# Altium project BLDC_Drive.PrjPcb
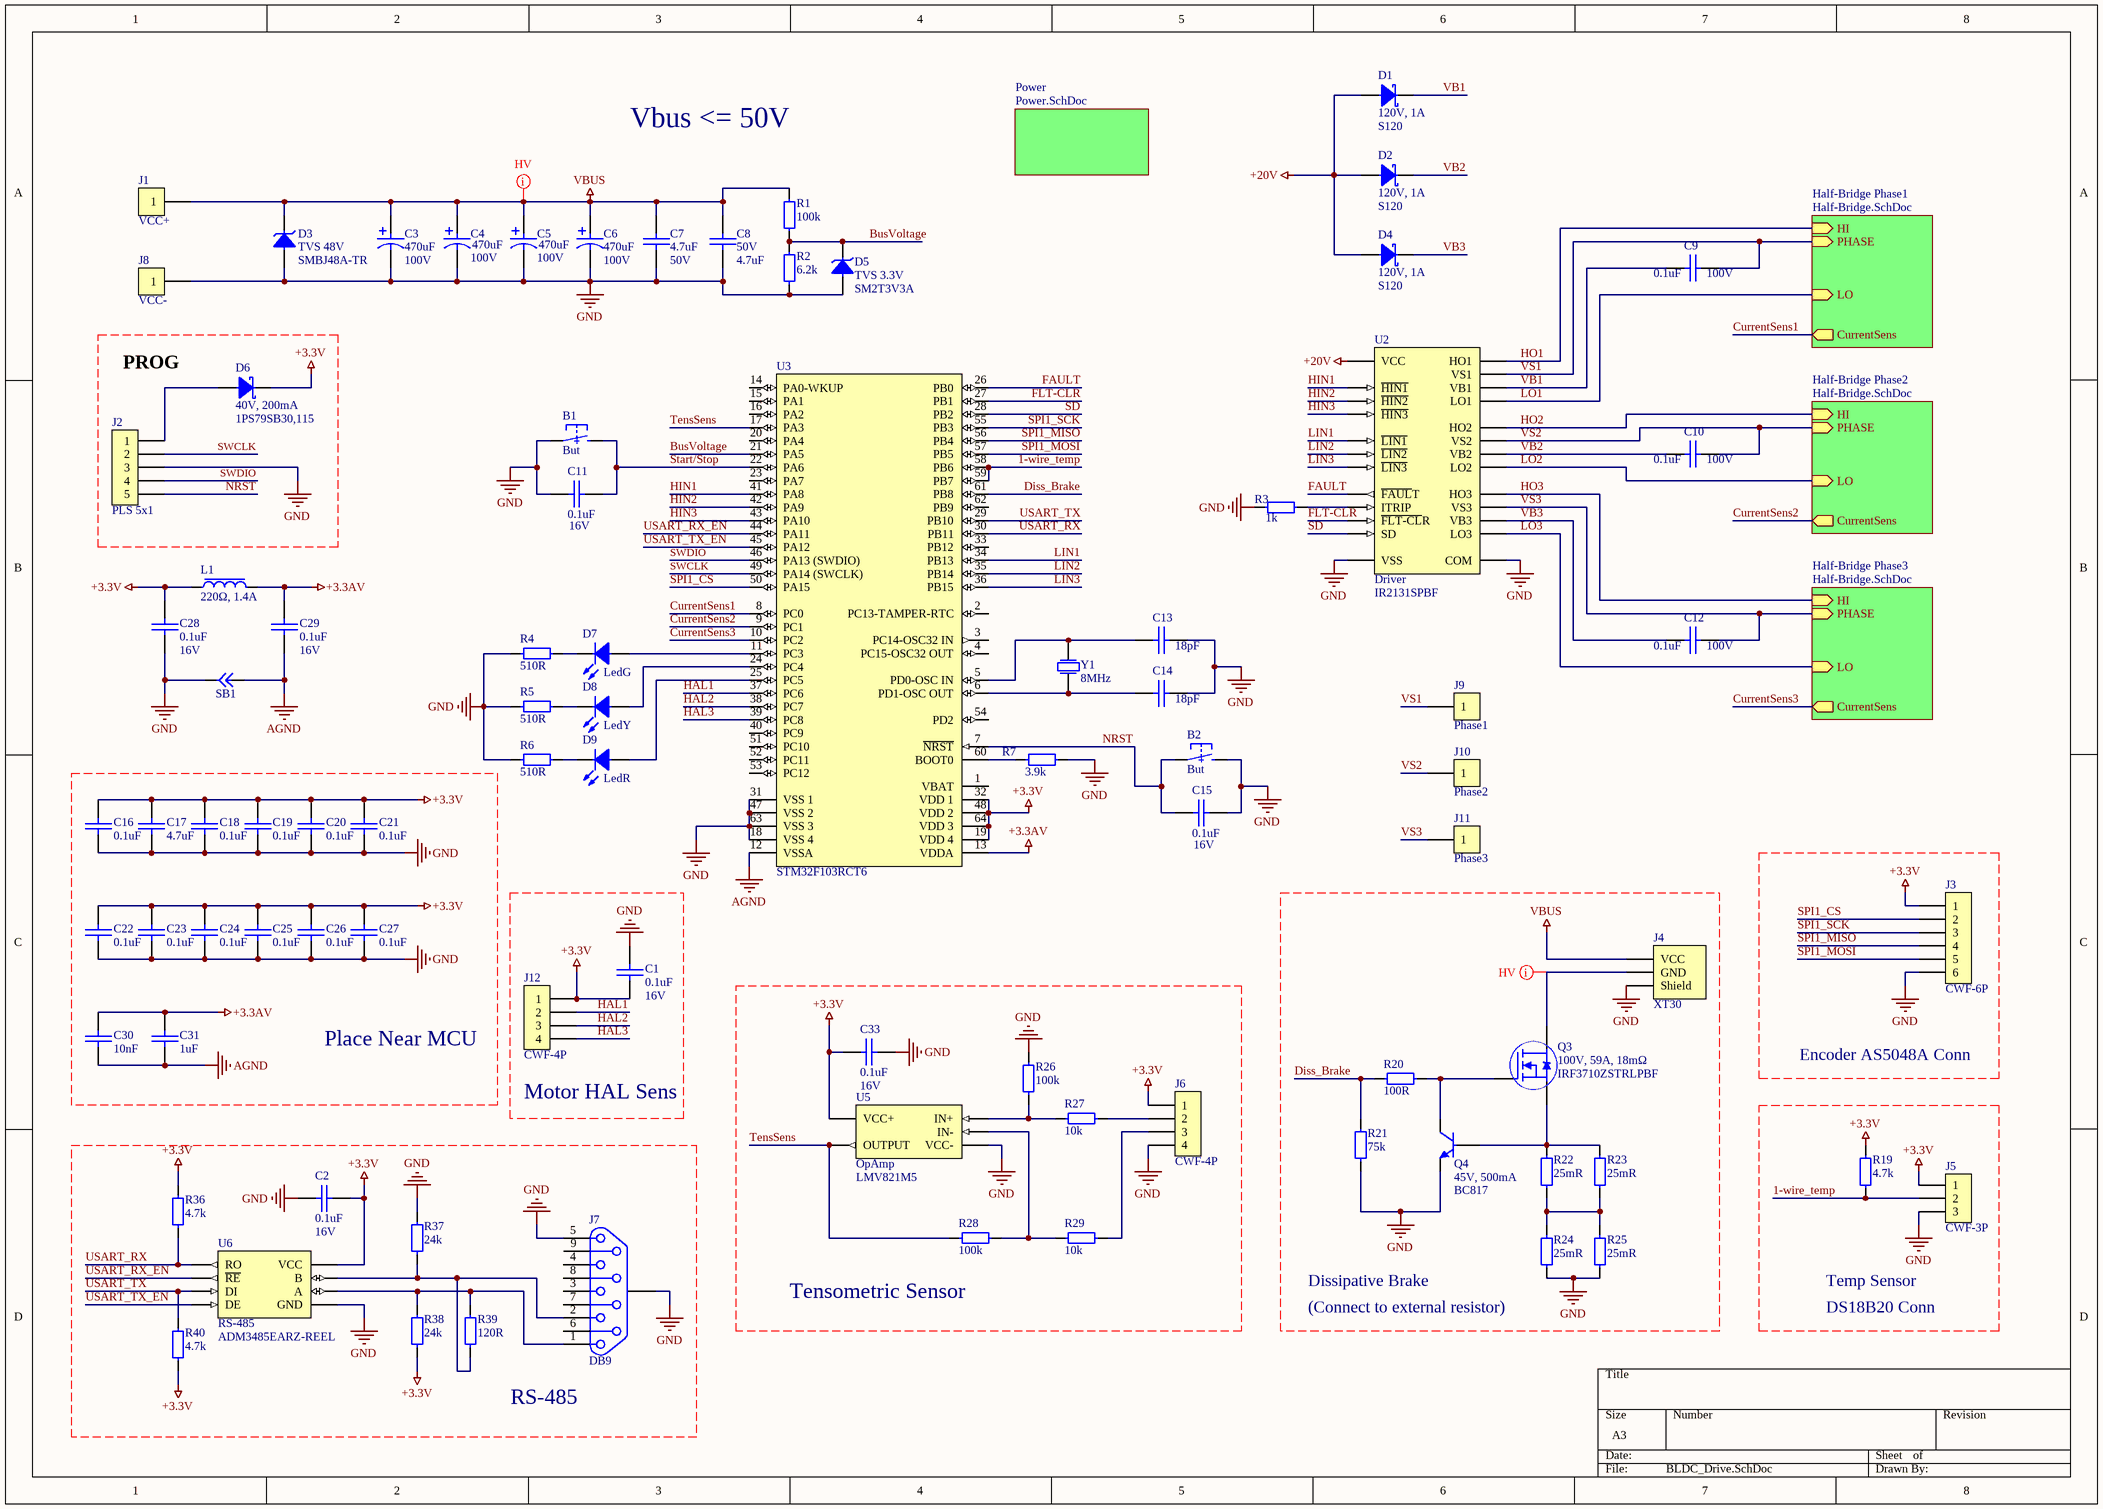
[diagram p0: BLDC_Drive.SchDoc]
3 sheets, 167 parts. Net scope: hierarchical (ports join the sheet entries above them; power ports are global).
Board file: BLDC_Drive.PcbDoc
Sheets:
  BLDC_Drive.SchDoc
    Half-Bridge Phase1 = Half-Bridge.SchDoc
    Half-Bridge Phase2 = Half-Bridge.SchDoc
    Half-Bridge Phase3 = Half-Bridge.SchDoc
    Power = Power.SchDoc

## Sheet BLDC_Drive.SchDoc
size A3; SheetNumber: 1; SheetTotal: 3

### Parts
(Parts that share a designator on the sheet are numbered #1, #2 ... from top to bottom, then left to right.)
B1  But  [BUTTON 6x3.5]
B2  But  [BUTTON 6x3.5]
C1  0.1uF  Voltage: 16V  [0603 Capicator]
C2  0.1uF  Voltage: 16V  [0603 Capicator]
C3  470uF  Voltage: 100V  [ECAP 16x25mm]
C4  470uF  Voltage: 100V  [ECAP 16x25mm]
C5  470uF  Voltage: 100V  [ECAP 16x25mm]
C6  470uF  Voltage: 100V  [ECAP 16x25mm]
C7  4.7uF  Voltage: 50V  [1206 Capacitor]
C8  4.7uF  Voltage: 50V  [1206 Capacitor]
C9  0.1uF  Voltage: 100V  [1206 Capacitor]
C10  0.1uF  Voltage: 100V  [1206 Capacitor]
C11  0.1uF  Voltage: 16V  [0603 Capicator]
C12  0.1uF  Voltage: 100V  [1206 Capacitor]
C13  18pF  [0603 Capicator]
C14  18pF  [0603 Capicator]
C15  0.1uF  Voltage: 16V  [0603 Capicator]
C16  0.1uF  [0603 Capicator]
C17  4.7uF  [0603 Capicator]
C18  0.1uF  [0603 Capicator]
C19  0.1uF  [0603 Capicator]
C20  0.1uF  [0603 Capicator]
C21  0.1uF  [0603 Capicator]
C22  0.1uF  [0603 Capicator]
C23  0.1uF  [0603 Capicator]
C24  0.1uF  [0603 Capicator]
C25  0.1uF  [0603 Capicator]
C26  0.1uF  [0603 Capicator]
C27  0.1uF  [0603 Capicator]
C28  0.1uF  Voltage: 16V  [0603 Capicator]
C29  0.1uF  Voltage: 16V  [0603 Capicator]
C30  10nF  [0603 Capicator]
C31  1uF  [0603 Capicator]
C33#1  0.1uF  Voltage: 16V  [0603 Capicator]
D1  120V, 1A  Part Number: S120  [SOD-123FL]
D2  120V, 1A  Part Number: S120  [SOD-123FL]
D3  TVS 48V  Part Number: SMBJ48A-TR  [SMB]
D4  120V, 1A  Part Number: S120  [SOD-123FL]
D5  TVS 3.3V  Part Number: SM2T3V3A  [DO-216AA]
D6  40V, 200mA  Part Number: 1PS79SB30,115  [SOD-523]
D7  LedG  [0805 LED]
D8  LedY  [0805 LED]
D9  LedR  [0805 LED]
J1  VCC+  [Cable25]
J2  PLS 5x1  [PLS 5x1]
J3  CWF-6P  [Conn6x1]
J4  XT30  [HEADER 2 XT30PW Male]
J5  CWF-3P  [Conn3x1]
J6  CWF-4P  [Conn4x1]
J7  DB9  [DB9]
J8  VCC-  [Cable25]
J9  Phase1  [Cable25]
J10  Phase2  [Cable25]
J11  Phase3  [Cable25]
J12  CWF-4P  [Conn4x1]
L1  220Ω, 1.4A  [0603 Inductor]
Q3#1  100V, 59A, 18mΩ  Part Number: IRF3710ZSTRLPBF  [D2-PAK (TO-262)]
Q4#1  45V, 500mA  Part Number: BC817  [SOT-23]
R1  100k  [0603 Resistor]
R2  6.2k  [0603 Resistor]
R3  1k  [0603 Resistor]
R4  510R  [0603 Resistor]
R5  510R  [0603 Resistor]
R6  510R  [0603 Resistor]
R7  3.9k  [0603 Resistor]
R19  4.7k  [0603 Resistor]
R20  100R  [0603 Resistor]
R21  75k  [0603 Resistor]
R22  25mR  [2512 Resistor]
R23  25mR  [2512 Resistor]
R24#1  25mR  [2512 Resistor]
R25#1  25mR  [2512 Resistor]
R26#1  100k  [0603 Resistor]
R27#1  10k  [0603 Resistor]
R28#1  100k  [0603 Resistor]
R29#1  10k  [0603 Resistor]
R36#1  4.7k  [0603 Resistor]
R37#1  24k  [0603 Resistor]
R38#1  24k  [0603 Resistor]
R39#1  120R  [0603 Resistor]
R40#1  4.7k  [0603 Resistor]
SB1  Circuit Breaker  [SB 0603]  (value not drawn)
U2  Driver  Part Number: IR2131SPBF  [SOIC-28 Wide]
U3  STM32F103RCT6  [LQFP64]
U5  OpAmp  Part Number: LMV821M5  [SOT-23-5]
U6#1  RS-485  Part Number: ADM3485EARZ-REEL  [SOIC-8]
Y1  8MHz  [hc-49sm]

### Sub-sheets
Half-Bridge Phase1 = Half-Bridge.SchDoc: LO (in), HI (in), CurrentSens (out), PHASE (in)
Half-Bridge Phase2 = Half-Bridge.SchDoc: LO (in), HI (in), CurrentSens (out), PHASE (in)
Half-Bridge Phase3 = Half-Bridge.SchDoc: LO (in), HI (in), CurrentSens (out), PHASE (in)
Power = Power.SchDoc: no entries

### Nets
+3.3AV: C29.2 C30.2 C31.2 L1.2 U3.13(VDDA)
+3.3V: C1.1 C2.2 C16.2 C17.2 C18.2 C19.1 C20.2 C21.1 C22.2 C23.2 C24.2 C25.2 C26.2 C27.2 C28.2 C33#1.1 D6.2 J3.1 J5.1 J6.1 J12.1 L1.1 R19.2 R36#1.2 R38#1.1 R40#1.1 U3.19(VDD_4) U3.32(VDD_1) U3.48(VDD_2) U3.64(VDD_3) U5.5(VCC+) U6#1.8(VCC)
+20V: D1.1 D2.1 D4.1 U2.1(VCC)
AGND: C29.1 C30.1 C31.1 SB1.2 U3.12(VSSA)
GND: B1.1 B2.2 C1.2 C2.1 C3.1 C4.1 C5.1 C6.1 C7.1 C8.1 C11.1 C13.2 C14.2 C15.2 C16.1 C17.1 C18.1 C19.2 C20.1 C21.2 C22.1 C23.1 C24.1 C25.1 C26.1 C27.1 C28.1 C33#1.2 D3.1 D5.1 J2.3 J3.6 J4.A(Shield) J5.3 J6.4 J7.5 J7.A J8.1 Q4#1.2 R2.1 R3.1 R4.1 R5.1 R6.1 R7.2 R21.1 R24#1.1 R25#1.1 R26#1.1 R37#1.2 SB1.1 U2.12(VSS) U2.13(COM) U3.18(VSS_4) U3.31(VSS_1) U3.47(VSS_2) U3.63(VSS_3) U5.2(VCC-) U6#1.5(GND)
VBUS: C3.2 C4.2 C5.2 C6.2 C7.2 C8.2 D3.2 J1.1 J4.1(VCC) R1.2
1-wire_temp: J5.2 R19.1 U3.58(PB6) U3.59(PB7)
BusVoltage: D5.2 R1.1 R2.2 U3.21(PA5)
CurrentSens1: U3.8(PC0) ; sheet Half-Bridge Phase1/CurrentSens
CurrentSens2: U3.9(PC1) ; sheet Half-Bridge Phase2/CurrentSens
CurrentSens3: U3.10(PC2) ; sheet Half-Bridge Phase3/CurrentSens
Diss_Brake: R20.1 R21.2 U3.61(PB8)
FAULT: U2.8(~{FAUL}T) U3.26(PB0)
FLT-CLR: U2.10(~{FLT-CL}R) U3.27(PB1)
HAL1: J12.2 U3.37(PC6)
HAL2: J12.3 U3.38(PC7)
HAL3: J12.4 U3.39(PC8)
HIN1: U2.2(~{HIN1}) U3.41(PA8)
HIN2: U2.3(~{HIN2}) U3.42(PA9)
HIN3: U2.4(~{HIN3}) U3.43(PA10)
HO1: U2.27(HO1) ; sheet Half-Bridge Phase1/HI
HO2: U2.23(HO2) ; sheet Half-Bridge Phase2/HI
HO3: U2.19(HO3) ; sheet Half-Bridge Phase3/HI
LIN1: U2.5(~{LIN1}) U3.34(PB13)
LIN2: U2.6(~{LIN2}) U3.35(PB14)
LIN3: U2.7(~{LIN3}) U3.36(PB15)
LO1: U2.16(LO1) ; sheet Half-Bridge Phase1/LO
LO2: U2.15(LO2) ; sheet Half-Bridge Phase2/LO
LO3: U2.14(LO3) ; sheet Half-Bridge Phase3/LO
NRST: B2.1 C15.1 J2.5 U3.7(~{NRST})
SD: U2.11(SD) U3.28(PB2)
SPI1_CS: J3.2 U3.50(PA15)
SPI1_MISO: J3.4 U3.56(PB4)
SPI1_MOSI: J3.5 U3.57(PB5)
SPI1_SCK: J3.3 U3.55(PB3)
Start/Stop: B1.2 C11.2 U3.22(PA6)
SWCLK: J2.2 U3.49(PA14_(SWCLK))
SWDIO: J2.4 U3.46(PA13_(SWDIO))
TensSens: R28#1.2 U3.17(PA3) U5.4(OUTPUT)
USART_RX: R36#1.1 U3.30(PB11) U6#1.1(RO)
USART_RX_EN: U3.44(PA11) U6#1.2(~{RE})
USART_TX: R40#1.2 U3.29(PB10) U6#1.4(DI)
USART_TX_EN: U3.45(PA12) U6#1.3(DE)
VB1: C9.2 D1.2 U2.28(VB1)
VB2: C10.2 D2.2 U2.24(VB2)
VB3: C12.2 D4.2 U2.20(VB3)
VS1: C9.1 J9.1 U2.26(VS1) ; sheet Half-Bridge Phase1/PHASE
VS2: C10.1 J10.1 U2.22(VS2) ; sheet Half-Bridge Phase2/PHASE
VS3: C12.1 J11.1 U2.18(VS3) ; sheet Half-Bridge Phase3/PHASE
NetC13_1: C13.1 U3.5(PD0-OSC_IN) Y1.2
NetC14_1: C14.1 U3.6(PD1-OSC_OUT) Y1.1
NetD6_1: D6.1 J2.1
NetD7_1: D7.1 U3.11(PC3)
NetD7_2: D7.2 R4.2
NetD8_1: D8.1 U3.24(PC4)
NetD8_2: D8.2 R5.2
NetD9_1: D9.1 U3.25(PC5)
NetD9_2: D9.2 R6.2
NetJ4_2: J4.2(GND) Q3#1.2(Drain)
NetJ6_2: J6.2 R27#1.2
NetJ6_3: J6.3 R29#1.2
NetJ7_1: J7.1 R38#1.2 R39#1.2 U6#1.6(A)
NetJ7_2: J7.2 R37#1.1 R39#1.1 U6#1.7(B)
NetQ3#1_1: Q3#1.1(Gate) Q4#1.3 R20.2
NetQ3#1_3: Q3#1.3(Source) Q4#1.1 R22.2 R23.2
NetR3_2: R3.2 U2.9(ITRIP)
NetR7_1: R7.1 U3.60(BOOT0)
NetR22_1: R22.1 R23.1 R24#1.2 R25#1.2
NetR26#1_2: R26#1.2 R27#1.1 U5.1(IN+)
NetR28#1_1: R28#1.1 R29#1.1 U5.3(IN-)

Not connected (* = marked no-connect by the designer): J7 3 4 6 7 8 9; U3 1(VBAT) 2(PC13-TAMPER-RTC) 3(PC14-OSC32_IN) 4(PC15-OSC32_OUT) 14(PA0-WKUP) 15(PA1) 16(PA2) 20(PA4) 23(PA7) 33(PB12) 40(PC9) 51(PC10) 52(PC11) 53(PC12) 54(PD2) 62(PB9)

### Layout directives
net class HV: NetJ4_2, VBUS

### Notes on the sheet
- Vbus <= 50V
- PROG
- Place Near MCU
- (near J12) Motor HAL Sens
- Encoder AS5048A Conn
- (near R28#1) Tensometric Sensor
- Dissipative Brake
- (Connect to external resistor)
- Temp Sensor
- DS18B20 Conn
- RS-485

### Library data of the parts
B1 B2 = Button 2 Conn: Button 2 Conn SMD; Part Number: L-KLS7-TS3608-5.0-180; Manufacturer: KLS electronic co ltd; Type: Button; ComponentLink1Description: Chip&Dip; ComponentLink1URL: https://www.chipdip.ru/product/kls7-ts3608-5.0-180-td-02xa
C1 C2 C11 C15 C16 C18-C29 C33#1 = Cap 0.1uF (0603): 0.1uF X7R 16V 10% 0603; Manufacturer: Murata Manufacturing; Part Number: GRM188R71C104KA01D; Type: Capacitor; ComponentLink1Description: Chip&Dip; ComponentLink1URL: https://www.chipdip.ru/product/grm188r71c104ka01d
  C16 C18-C27: Voltage: 16V
C3-C6 = Cap Pol 470uF (100V): ECAP, 100V, 105°C, 20%, 8x16mm; Part Number: JRB2A471M07501600250000B; Manufacturer: JB; Type: Capacitor; ComponentLink1Description: Chip&Dip; ComponentLink1URL: https://www.chipdip.ru/product0/9000565913
C7 C8 = Cap 4.7uF (1206): 4.7uF X7R 10% 50V 1206; Manufacturer: Murata Manufacturing; Part Number: GRM31CR71H475KA12L; Type: Capacitor; ComponentLink1Description: Chip&Dip; ComponentLink1URL: https://www.chipdip.ru/product/grm31cr71h475ka12l
C9 C10 C12 = Cap 0.1uF (1206): 0.1uF X7R 100V 10% 1206; Manufacturer: Murata Manufacturing; Part Number: GRM319R72A104KA01D; Type: Capacitor; ComponentLink1Description: Chip&Dip; ComponentLink1URL: https://www.chipdip.ru/product0/9000697437
C13 C14 = Cap 18pF (0603): 18pF NP0 50V 5% 0603; Manufacturer: Murata Manufacturing; Part Number: GRM1885C1H180JA01D; Type: Capacitor; ComponentLink1Description: Chip&Dip; ComponentLink1URL: https://www.chipdip.ru/product/grm1885c1h180j; Voltage: 50V
C17 = Cap 4.7uF (0603): 4.7uF X5R 25V 10% 0603; Manufacturer: Murata Manufacturing; Part Number: GRM188R61E475KE11D; Type: Capacitor; ComponentLink1Description: Chip&Dip; ComponentLink1URL: https://www.chipdip.ru/product0/9000348448; Voltage: 25V
C30 = Cap 10nF (0603): X7R 10nF 100V 10% 0603; Manufacturer: Murata Manufacturing; Part Number: GRM188R72A103KA01D; Type: Capacitor; ComponentLink1Description: Chip&Dip; ComponentLink1URL: https://www.chipdip.ru/product/grm188r72a103ka01d; Voltage: 100V
C31 = Cap 1uF (0603): 1uF X5R 25V 10% 0603; Manufacturer: Murata Manufacturing; Part Number: GRM188R61E105KAADD; Type: Capacitor; ComponentLink1Description: Chip&Dip; ComponentLink1URL: https://www.chipdip.ru/product/grm188r61e105k; Voltage: 25V
D1 D2 D4 = Diode Schottky 120V (SOD-123FL): Manufacturer: Yangzhou Yangjie Electronic Technology Co; Type: Diode; ComponentLink1Description: DataSheet; ComponentLink1URL: https://static.chipdip.ru/lib/152/DOC001152954.pdf; ComponentLink2Description: Chip&Dip; ComponentLink2URL: https://www.chipdip.ru/product/s120
D3 = TVS Diode 48V [SMBJ]: 600W; Manufacturer: STMicroelectronics; Type: Diode; ComponentLink1Description: DataSheet; ComponentLink1URL: https://static.chipdip.ru/lib/252/DOC011252020.pdf; ComponentLink2Description: Chip&Dip; ComponentLink2URL: https://www.chipdip.ru/product/smbj48a
D5 = TVS Diode 3.3V [SM2T]: High peak pulse power: 200 W (10/1000 μs); Manufacturer: STMicroelectronics; Type: Diode; ComponentLink1Description: DataSheet; ComponentLink1URL: https://www.st.com/resource/en/datasheet/sm2t3v3a.pdf; ComponentLink2Description: Chip&Dip; ComponentLink2URL: https://www.chipdip.ru/product0/8283670575
D6 = Diode Schottky (SOD-523): Schottky Barrier Diodes, 200mA to 500mA; Manufacturer: Nexperia; Type: Diode; ComponentLink1Description: DataSheet; ComponentLink1URL: https://static.chipdip.ru/lib/583/DOC001583065.pdf; ComponentLink2Description: Chip&Dip; ComponentLink2URL: https://www.chipdip.ru/product/1ps79sb30.115
D7 = Led Green: Led Green SMD 1608, 120°, 525nM; Part Number: TO-1608BC-PG; Manufacturer: Taiwan Oasis Technology; Type: Diode; ComponentLink1Description: Chip&Dip; ComponentLink1URL: https://www.chipdip.ru/product/to-1608bc-pg
D8 = Led Yellow: SMD 1608, 247mcd, 120°, 592nM (High Bright Yellow); Part Number: TO-1608BC-MYF; Manufacturer: Taiwan Oasis Technology; Type: Diode; ComponentLink1Description: Chip&Dip; ComponentLink1URL: https://www.chipdip.ru/product/to-1608bc-myf
D9 = Led Red: SMD 1608, 112mcd, 120°, 630nM (Ultra Bright Red); Part Number: TO-1608BC-MRE; Manufacturer: Taiwan Oasis Technology; Type: Diode; ComponentLink1Description: Chip&Dip; ComponentLink1URL: https://www.chipdip.ru/product/to-1608bc-mre
J1 J8-J11 = Conn 1 [Cable]
J2 = Conn 5 (PLS): Header, 5-Pin
J3 = Conn 6 [CWF]: Right-Angle; Manufacturer: Ningbo connfly electronic (Zhenqin); Part Number: DS1069-6MRW6X-B; Type: Connector; ComponentLink1Description: Chip&Dip; ComponentLink1URL: https://www.chipdip.ru/product/cwf-6r
J4 = Connector XT30PW-Male: Standart RC Connector; Part Number: XT30PW; Manufacturer: Amass; ComponentLink1Description: AliExpress; ComponentLink1URL: https://ru.aliexpress.com/item/4000070113352.html?spm=a2g0o.productlist.0.0.39dd34bfyYuspa&algo_pvid=4d7d83f5-6270-4220-b100-9b5f13b0846d&algo_expid=4d7d83f5-6270-4220-b100-9b5f13b0846d-3&btsid=c67bc929-e3be-4af3-9fd9-25ac13ce4818&ws_ab_test=searchweb0_0,searchweb201602_,searchweb201603_55; Type: Connector
J5 = Conn 3 [CWF]: Right-Angle; Manufacturer: Ningbo connfly electronic (Zhenqin); Part Number: DS1069-3MRW6SA; Type: Connector; ComponentLink1Description: Chip&Dip; ComponentLink1URL: https://www.chipdip.ru/product/cwf-3r
J6 J12 = Conn 4 [CWF]: Right-Angle; Part Number: DS1069-4MRW6XB; Manufacturer: Ningbo connfly electronic (Zhenqin); Type: Connector; ComponentLink1Description: Chip&Dip; ComponentLink1URL: https://www.chipdip.ru/product/cwf-4r
J7 = Connector DB9: CONN D-SUB PLUG 9POS R/A SOLDER; Part Number: DR09S-H-CN; Manufacturer: Auk Contractors; ComponentLink1Description: DataSheet; ComponentLink1URL: https://static.chipdip.ru/lib/009/DOC004009535.pdf; ComponentLink2Description: Chip&Dip; ComponentLink2URL: https://www.chipdip.ru/product/dr09s-h-cn-drb-9fa-dbr-9f; Type: Connector
L1 = Ferrite Bead 220 (0603): Chip beads for power line. GHz noise countermeasure; Part Number: BLM18PG221SN1D; Manufacturer: Murata; Type: Inductor; ComponentLink1Description: DataSheet; ComponentLink1URL: https://product.tdk.com/en/system/files?file=dam/doc/product/emc/emc/beads/catalog/beads_commercial_power_mpz1005-e_en.pdf; ComponentLink2Description: Electronshik; ComponentLink2URL: https://www.electronshik.ru/item/MUR/BLM18PG221SN1D; ComponentLink3Description: Chip&Dip; ComponentLink3URL: https://www.chipdip.ru/product0/8007351955
Q3#1 = MOSFET-N [IRF]: Power MOSFET utilizes the latest processing techniques to achieve extremely low on-resistance per silicon area; Manufacturer: Infineon; Type: Transistor; ComponentLink1Description: DataSheet; ComponentLink1URL: https://static.chipdip.ru/lib/300/DOC000300442.pdf; ComponentLink2Description: Chip&Dip; ComponentLink2URL: https://www.chipdip.ru/product/irf3710zspbf
Q4#1 = NPN [BC817]: NPN general-purpose transistors; Manufacturer: Nexperia; Type: Transistor; ComponentLink1Description: DataSheet; ComponentLink1URL: https://static.chipdip.ru/lib/156/DOC000156781.pdf; ComponentLink2Description: Chip&Dip; ComponentLink2URL: https://www.chipdip.ru/product/bc817-40
R1 R26#1 R28#1 = Res 100k (0603): 0.1W 0603 100k, 1%; Part Number: RC0603FR-07100KL; Manufacturer: Taiwan; Type: Resistor; ComponentLink1Description: Chip&Dip; ComponentLink1URL: https://www.chipdip.ru/product0/9000079760
R2 = Res 6.2k (0603): 0.1W 0603 6.2k, 1%; Part Number: RC0603FR-076K2L; Manufacturer: Taiwan; Type: Resistor; ComponentLink1Description: Chip&Dip; ComponentLink1URL: https://www.chipdip.ru/product/0.1w-0603-6.2-kom-1
R3 = Res 1k (0603): 0.1W 0603 1k, 1%; Part Number: RC0603FR-071KL; Manufacturer: Taiwan; Type: Resistor; ComponentLink1Description: Chip&Dip; ComponentLink1URL: https://www.chipdip.ru/product0/9000079676
R4-R6 = Res 510R (0603): 0.1W 0603 510R, 1%; Part Number: RC0603FR-07510RL; Manufacturer: Taiwan; Type: Resistor; ComponentLink1Description: Chip&Dip; ComponentLink1URL: https://www.chipdip.ru/product0/9000079669
R7 = Res 3.9k (0603): 0.1W 0603 3.9k, 1%; Part Number: RC0603FR-073K9L; Manufacturer: Taiwan; Type: Resistor; ComponentLink1Description: Chip&Dip; ComponentLink1URL: https://www.chipdip.ru/product0/9000079726
R19 R36#1 R40#1 = Res 4.7k (0603): 0.1W 0603 4.7k, 1%; Part Number: RC0603FR-074K7L; Manufacturer: Taiwan; Type: Resistor; ComponentLink1Description: Chip&Dip; ComponentLink1URL: https://www.chipdip.ru/product0/9000079728
R20 = Res 100R (0603): 0.1W 0603 100R, 1%; Part Number: RC0603FR-07100RL; Manufacturer: Taiwan; Type: Resistor; ComponentLink1Description: Chip&Dip; ComponentLink1URL: https://www.chipdip.ru/product0/9000079616
R21 = Res 75k (0603): 0.1W 0603 75k, 1%; Part Number: RC0603FR-0775KL; Manufacturer: Taiwan; Type: Resistor; ComponentLink1Description: Chip&Dip; ComponentLink1URL: https://www.chipdip.ru/product0/9000079757
R22 R23 R24#1 R25#1 = Res 25mR (2512): 1W 2512 25mR, 1%; Part Number: WSL2512R0250FEA; Manufacturer: Vishay; Type: Resistor; ComponentLink1Description: Electronshik; ComponentLink1URL: https://www.electronshik.ru/item/VISHAY/WSL2512R0250FEA
R27#1 R29#1 = Res 10k (0603): 0.1W 0603 10k, 1%; Part Number: RC0603FR-0710KL; Manufacturer: Taiwan; Type: Resistor; ComponentLink1Description: Chip&Dip; ComponentLink1URL: https://www.chipdip.ru/product0/9000079736
R37#1 R38#1 = Res 24k (0603): 0.1W 0603 24k, 1%; Part Number: RC0603FR-0724KL; Manufacturer: Taiwan; Type: Resistor; ComponentLink1Description: Chip&Dip; ComponentLink1URL: https://www.chipdip.ru/product/0.1w-0603-24-kom-1
R39#1 = Res 120R (0603): 0.1W 0603 120R, 1%; Part Number: RC0603FR-07120RL; Manufacturer: Taiwan; Type: Resistor; ComponentLink1Description: Chip&Dip; ComponentLink1URL: https://www.chipdip.ru/product/0.1w-0603-120-om-1
U2 = MOSFET Driver 3 Channel: High voltage, high speed power / MOSFET and IGBT driver with three independent high / and low side referenced output channels; Manufacturer: Infineon; ComponentLink1Description: Electronshik; ComponentLink1URL: https://www.electronshik.ru/item/INFIN/IR2131SPBF; ComponentLink2Description: DataSheet; ComponentLink2URL: https://static.chipdip.ru/lib/300/DOC000300114.pdf; Type: IC; ComponentLink3Description: Chip&Dip; ComponentLink3URL: https://www.chipdip.ru/product/ir2131s
U3 = STM32F103RCT6: IC MCU 32BIT 256KB FLASH 64LQFP; Manufacturer: STMicroelectronics; Part Number: STM32F103RCT6; Type: IC; ComponentLink1Description: DataSheet; ComponentLink1URL: https://www.st.com/resource/en/datasheet/cd00191185.pdf; ComponentLink2Description: Chip&Dip; ComponentLink2URL: https://www.chipdip.ru/product/stm32f103rct6-2
U5 = OpAmp [LMV821]: A single low power precision Operational Amplifier intended for use in a wide range of applications; Manufacturer: Texas Instruments; ComponentLink1Description: DataSheet; ComponentLink1URL: https://static.chipdip.ru/lib/235/DOC000235297.pdf; ComponentLink2Description: Chip&Dip; ComponentLink2URL: https://www.chipdip.ru/product/lmv821m5; Type: IC
U6#1 = RS-485 Transiever: The ADM3485E is a 3.3 V, low power data transceiver with ±15 kV ESD protection, suitable for half-duplex communication on multipoint bus transmission lines.; Manufacturer: Analog Devices; ComponentLink1Description: Chip&Dip; ComponentLink1URL: https://www.chipdip.ru/product0/8957213292; ComponentLink2Description: DataSheet; ComponentLink2URL: https://static.chipdip.ru/lib/154/DOC013154525.pdf; Type: IC
Y1 = Crystal 8MHz SMD: Crystal. HC-49SM (US); Manufacturer: China; Part Number: 8.000MHzHC-49SM; Type: Crystal; ComponentLink1Description: Chip&Dip; ComponentLink1URL: https://www.chipdip.ru/product/8mhz-hc-49sm

## Sheet Half-Bridge.SchDoc
size A4; SheetNumber: 2; SheetTotal: 3
Used 3 times, as channels Half-Bridge Phase1, Half-Bridge Phase2, Half-Bridge Phase3. Parts and nets are listed once, with the designators drawn on the sheet.
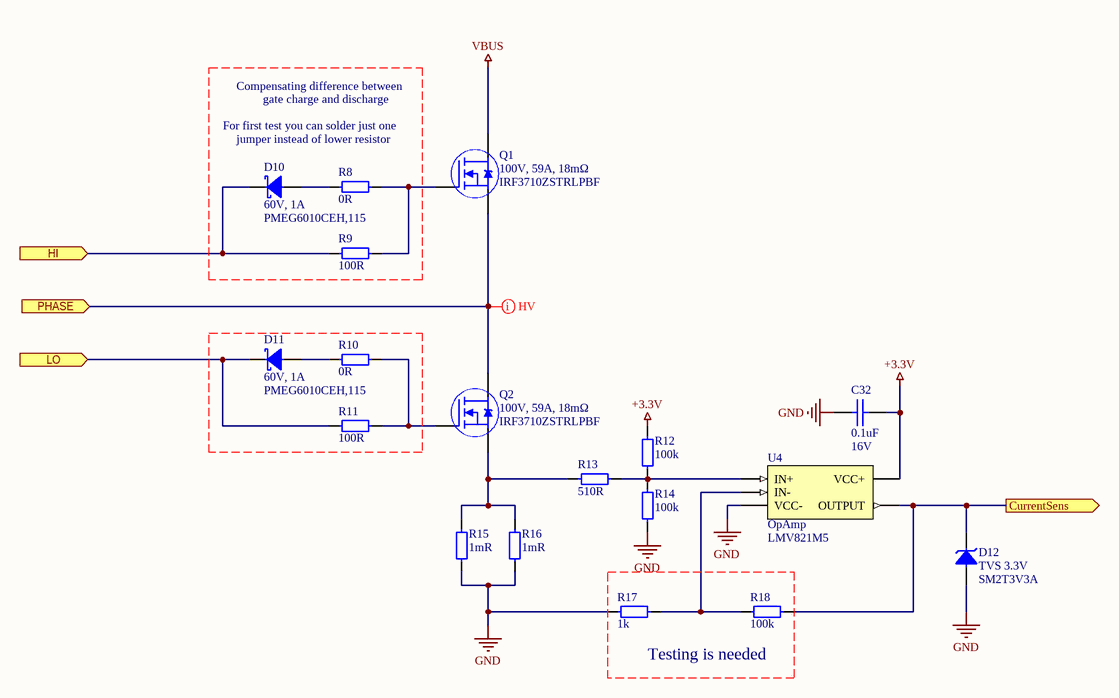
[diagram p1: Half-Bridge.SchDoc]

### Parts
C32  0.1uF  Voltage: 16V  [0603 Capicator]
D10  60V, 1A  Part Number: PMEG6010CEH,115  [SOD-123FL]
D11  60V, 1A  Part Number: PMEG6010CEH,115  [SOD-123FL]
D12  TVS 3.3V  Part Number: SM2T3V3A  [DO-216AA]
Q1  100V, 59A, 18mΩ  Part Number: IRF3710ZSTRLPBF  [D2-PAK (TO-262)]
Q2  100V, 59A, 18mΩ  Part Number: IRF3710ZSTRLPBF  [D2-PAK (TO-262)]
R8  0R  [0603 Resistor]
R9  100R  [0603 Resistor]
R10  0R  [0603 Resistor]
R11  100R  [0603 Resistor]
R12  100k  [0603 Resistor]
R13  510R  [0603 Resistor]
R14  100k  [0603 Resistor]
R15  1mR  [2512 Resistor]
R16  1mR  [2512 Resistor]
R17  1k  [0603 Resistor]
R18  100k  [0603 Resistor]
U4  OpAmp  Part Number: LMV821M5  [SOT-23-5]

### Ports
CurrentSens (out, see BLDC_Drive[7A]), HI (in, see BLDC_Drive[7A]), LO (in, see BLDC_Drive[7A]), PHASE (in, see BLDC_Drive[7A])

### Nets
+3.3V: C32.1 R12.2 U4.5(VCC+)
GND: C32.2 D12.1 R14.1 R15.1 R16.1 R17.1 U4.2(VCC-)
VBUS: Q1.2(Drain)
CurrentSens: D12.2 R18.2 U4.4(OUTPUT) ; port CurrentSens
HI: D10.2 R9.1 ; port HI
LO: D11.2 R11.1 ; port LO
PHASE: Q1.3(Source) Q2.2(Drain) ; port PHASE
NetD10_1: D10.1 R8.1
NetD11_1: D11.1 R10.1
NetQ1_1: Q1.1(Gate) R8.2 R9.2
NetQ2_1: Q2.1(Gate) R10.2 R11.2
NetQ2_3: Q2.3(Source) R13.1 R15.2 R16.2
NetR12_1: R12.1 R13.2 R14.2 U4.1(IN+)
NetR17_2: R17.2 R18.1 U4.3(IN-)

### Channels
Half-Bridge Phase1: designators C32=C33#2 D10=D10 D11=D11 D12=D12 Q1=Q3#2 Q2=Q4#2 R8=R24#2 R9=R25#2 R10=R26#2 R11=R27#2 R12=R28#2 R13=R29#2 R14=R30#1 R15=R31#1 R16=R32#1 R17=R33#1 R18=R34#1 U4=U6#2; ports CurrentSens=CurrentSens1 HI=HO1 LO=LO1 PHASE=VS1
Half-Bridge Phase2: designators C32=C34#1 D10=D13#1 D11=D14#1 D12=D15#1 Q1=Q5 Q2=Q6 R8=R35#1 R9=R36#2 R10=R37#2 R11=R38#2 R12=R39#2 R13=R40#2 R14=R41 R15=R42 R16=R43 R17=R44 R18=R45 U4=U7#1; ports CurrentSens=CurrentSens2 HI=HO2 LO=LO2 PHASE=VS2
Half-Bridge Phase3: designators C32=C35#1 D10=D16 D11=D17 D12=D18 Q1=Q7 Q2=Q8 R8=R46 R9=R47 R10=R48 R11=R49 R12=R50 R13=R51 R14=R52 R15=R53 R16=R54 R17=R55 R18=R56 U4=U8#1; ports CurrentSens=CurrentSens3 HI=HO3 LO=LO3 PHASE=VS3

### Layout directives
net class HV: VS1

### Notes on the sheet
- (near Q1) For first test you can solder just one
- Compensating difference between
- jumper instead of lower resistor
- gate charge and discharge
- Testing is needed

### Library data of the parts
C32 = Cap 0.1uF (0603): as C1 on sheet BLDC_Drive; ComponentLink1Description: Chip&Dip; ComponentLink1URL: https://www.chipdip.ru/product/grm188r71c104ka01d
D10 D11 = Diode Schottky 60V (SOD-123FL): Manufacturer: Nexperia; Type: Diode; ComponentLink1Description: DataSheet; ComponentLink1URL: https://static.chipdip.ru/lib/614/DOC011614194.pdf; ComponentLink2Description: Chip&Dip; ComponentLink2URL: https://www.chipdip.ru/product/pmeg6010ceh.115
D12 = TVS Diode 3.3V [SM2T]: as D5 on sheet BLDC_Drive; ComponentLink1Description: DataSheet; ComponentLink1URL: https://www.st.com/resource/en/datasheet/sm2t3v3a.pdf; ComponentLink2Description: Chip&Dip; ComponentLink2URL: https://www.chipdip.ru/product0/8283670575
Q1 Q2 = MOSFET-N [IRF]: as Q3#1 on sheet BLDC_Drive; ComponentLink1Description: DataSheet; ComponentLink1URL: https://static.chipdip.ru/lib/300/DOC000300442.pdf; ComponentLink2Description: Chip&Dip; ComponentLink2URL: https://www.chipdip.ru/product/irf3710zspbf
R8 R10 = Res 0R (0603): 0.1W 0603 0R, 5%; Part Number: RC0603JR-070RL; Manufacturer: Taiwan; Type: Resistor; ComponentLink1Description: Chip&Dip; ComponentLink1URL: https://www.chipdip.ru/product0/9000070541
R9 R11 = Res 100R (0603): as R20 on sheet BLDC_Drive; Type: Resistor; ComponentLink1Description: Chip&Dip; ComponentLink1URL: https://www.chipdip.ru/product0/9000079616
R12 R14 R18 = Res 100k (0603): as R1 on sheet BLDC_Drive; Type: Resistor; ComponentLink1Description: Chip&Dip; ComponentLink1URL: https://www.chipdip.ru/product0/9000079760
R13 = Res 510R (0603): as R4 on sheet BLDC_Drive; Type: Resistor; ComponentLink1Description: Chip&Dip; ComponentLink1URL: https://www.chipdip.ru/product0/9000079669
R15 R16 = Res Precise 1mR (2512): Current Shunt, 1W 2512 1mR 1%; Part Number: WSL25121L000FEA; Manufacturer: Vishay; Type: Resistor; ComponentLink1Description: Electronshik; ComponentLink1URL: https://www.electronshik.ru/item/VISHAY/WSL25121L000FEA
R17 = Res 1k (0603): as R3 on sheet BLDC_Drive; Type: Resistor; ComponentLink1Description: Chip&Dip; ComponentLink1URL: https://www.chipdip.ru/product0/9000079676
U4 = OpAmp [LMV821]: as U5 on sheet BLDC_Drive; ComponentLink1Description: DataSheet; ComponentLink1URL: https://static.chipdip.ru/lib/235/DOC000235297.pdf; ComponentLink2Description: Chip&Dip; ComponentLink2URL: https://www.chipdip.ru/product/lmv821m5; Type: IC

## Sheet Power.SchDoc
size A4; SheetNumber: 3; SheetTotal: 3
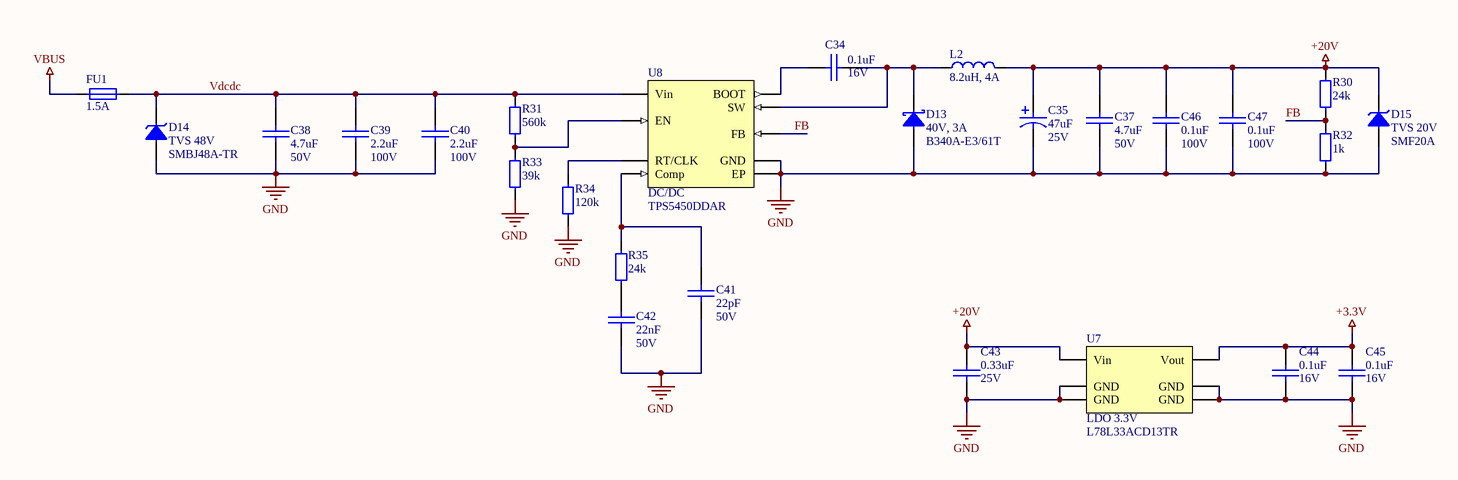
[diagram p2: Power.SchDoc]

### Parts
(Parts that share a designator on the sheet are numbered #1, #2 ... from top to bottom, then left to right.)
C34#2  0.1uF  Voltage: 16V  [0603 Capicator]
C35#2  47uF  Voltage: 25V  [Bar Cap 6.3x7.7]
C37  4.7uF  Voltage: 50V  [1206 Capacitor]
C38  4.7uF  Voltage: 50V  [1206 Capacitor]
C39  2.2uF  Voltage: 100V  [1206 Capacitor]
C40  2.2uF  Voltage: 100V  [1206 Capacitor]
C41  22pF  Voltage: 50V  [0603 Capicator]
C42  22nF  Voltage: 50V  [0603 Capicator]
C43  0.33uF  Voltage: 25V  [0805 Capicator]
C44  0.1uF  Voltage: 16V  [0603 Capicator]
C45  0.1uF  Voltage: 16V  [0603 Capicator]
C46  0.1uF  Voltage: 100V  [1206 Capacitor]
C47  0.1uF  Voltage: 100V  [1206 Capacitor]
D13#2  40V, 3A  Part Number: B340A-E3/61T  [SMA]
D14#2  TVS 48V  Part Number: SMBJ48A-TR  [SMB]
D15#2  TVS 20V  Part Number: SMF20A  [SOD-123FL]
FU1  1.5A  [1812 Fuse]
L2  8.2uH, 4A  [Inductor 6.9x6.5]
R30#2  24k  [0603 Resistor]
R31#2  560k  [0603 Resistor]
R32#2  1k  [0603 Resistor]
R33#2  39k  [0603 Resistor]
R34#2  120k  [0603 Resistor]
R35#2  24k  [0603 Resistor]
U7#2  LDO 3.3V  Part Number: L78L33ACD13TR  [SOIC-8]
U8#2  DC/DC  Part Number: TPS5450DDAR  [HSOP-8]

### Nets
+3.3V: C44.2 C45.2 U7#2.1(Vout)
+20V: C35#2.2 C37.2 C43.2 C46.2 C47.2 D15#2.2 L2.2 R30#2.2 U7#2.8(Vin)
GND: C35#2.1 C37.1 C38.1 C39.1 C40.1 C41.1 C42.1 C43.1 C44.1 C45.1 C46.1 C47.1 D13#2.1 D14#2.1 D15#2.1 R32#2.1 R33#2.1 R34#2.1 U7#2.2(GND) U7#2.3(GND) U7#2.6(GND) U7#2.7(GND) U8#2.7(GND) U8#2.A(EP)
VBUS: FU1.1
FB: R30#2.1 R32#2.2 U8#2.5(FB)
Vdcdc: C38.2 C39.2 C40.2 D14#2.2 FU1.2 R31#2.2 U8#2.2(Vin)
NetC34#2_1: C34#2.1 U8#2.1(BOOT)
NetC34#2_2: C34#2.2 D13#2.2 L2.1 U8#2.8(SW)
NetC41_2: C41.2 R35#2.2 U8#2.6(Comp)
NetC42_2: C42.2 R35#2.1
NetR31#2_1: R31#2.1 R33#2.2 U8#2.3(EN)
NetR34#2_2: R34#2.2 U8#2.4(RT/CLK)

### Library data of the parts
C34#2 C44 C45 = Cap 0.1uF (0603): as C1 on sheet BLDC_Drive; ComponentLink1Description: Chip&Dip; ComponentLink1URL: https://www.chipdip.ru/product/grm188r71c104ka01d
C35#2 = Cap Pol 47uF (25V): ECAP SMD,  25V, 105°C, 20%; Part Number: JCK1E470M063054; Manufacturer: JB; Type: Capacitor; ComponentLink1Description: Chip&Dip; ComponentLink1URL: https://www.chipdip.ru/product0/9000565730
C37 C38 = Cap 4.7uF (1206): as C7 on sheet BLDC_Drive; ComponentLink1Description: Chip&Dip; ComponentLink1URL: https://www.chipdip.ru/product/grm31cr71h475ka12l
C39 C40 = Cap 2.2uF (1206): 2.2uF X7R 10% 100V 1206; Manufacturer: Murata Manufacturing; Part Number: GRM31CR72A225KA73L; Type: Capacitor; ComponentLink1Description: Chip&Dip; ComponentLink1URL: https://www.chipdip.ru/product0/9000385299
C41 = Cap 22pF (0603): 22pF NP0 50V 5% 0603; Manufacturer: Taiwan; Part Number: MLCC22pFNPO50V5%0603; Type: Capacitor; ComponentLink1Description: Chip&Dip; ComponentLink1URL: https://www.chipdip.ru/product0/472852716
C42 = Cap 22nF (0603): 22nF X7R 50V 10% 0603; Manufacturer: Murata Manufacturing; Part Number: GRM188R71H223KA01D; Type: Capacitor; ComponentLink1Description: Chip&Dip; ComponentLink1URL: https://www.chipdip.ru/product/grm188r71h223k
C43 = Cap 0.33uF (0805): 0.33uF X7R 25V 10% 0805; Manufacturer: Murata Manufacturing; Part Number: GRM21BR71E334KA01L; Type: Capacitor; ComponentLink1Description: Chip&Dip; ComponentLink1URL: https://www.chipdip.ru/product/grm21br71e334k
C46 C47 = Cap 0.1uF (1206): as C9 on sheet BLDC_Drive; ComponentLink1Description: Chip&Dip; ComponentLink1URL: https://www.chipdip.ru/product0/9000697437
D13#2 = Diode Schottky (SMA): Diode Schottky 3A 40V; Manufacturer: Vishay; Type: Diode; ComponentLink1Description: DataSheet; ComponentLink1URL: https://static.chipdip.ru/lib/652/DOC001652710.pdf; ComponentLink2Description: Chip&Dip; ComponentLink2URL: https://www.chipdip.ru/product/b340a-e3-61t-2
D14#2 = TVS Diode 48V [SMBJ]: as D3 on sheet BLDC_Drive; ComponentLink1Description: DataSheet; ComponentLink1URL: https://static.chipdip.ru/lib/252/DOC011252020.pdf; ComponentLink2Description: Chip&Dip; ComponentLink2URL: https://www.chipdip.ru/product/smbj48a
D15#2 = TVS Diode 20V [SMF]: 200W; Manufacturer: Yangzhou Yangjie Electronic Technology Co., Ltd.; Type: Diode; ComponentLink1Description: DataSheet; ComponentLink1URL: https://static.chipdip.ru/lib/15https://static.chipdip.ru/lib/152/DOC001152952.pdf2/DOC001152952.pdf; ComponentLink2Description: Chip&Dip; ComponentLink2URL: https://www.chipdip.ru/product/smf20a
FU1 = Fuse Resettable 1.5A: Part Number: MF-MSMF150-2; Manufacturer: Bourns; Type: Fuse; ComponentLink1Description: Chip&Dip; ComponentLink1URL: https://www.chipdip.ru/product0/8009663123; ComponentLink2Description: DataSheet; ComponentLink2URL: https://static.chipdip.ru/lib/167/DOC011167164.pdf
L2 = Inductor 8.2uH (4A): 8.2 uH, 4А, 20%, 6.9х6.5х3mm; Part Number: IHLP2525CZER8R2M01; Manufacturer: Vishay; Type: Inductor; ComponentLink1Description: DataSheet; ComponentLink1URL: https://static.chipdip.ru/lib/957/DOC011957119.pdf; ComponentLink2Description: Chip&Dip; ComponentLink2URL: https://www.chipdip.ru/product0/8698549440; ComponentLink3Description: Electronshik; ComponentLink3URL: https://www.electronshik.ru/item/VISHAY/IHLP2525CZER8R2M01
R30#2 R35#2 = Res 24k (0603): as R37#1 on sheet BLDC_Drive; Type: Resistor; ComponentLink1Description: Chip&Dip; ComponentLink1URL: https://www.chipdip.ru/product/0.1w-0603-24-kom-1
R31#2 = Res 560k (0603): 0.1W 0603 560k, 1%; Part Number: RC0603FR-07560KL; Manufacturer: Taiwan; Type: Resistor; ComponentLink1Description: Chip&Dip; ComponentLink1URL: https://www.chipdip.ru/product0/9000079778
R32#2 = Res 1k (0603): as R3 on sheet BLDC_Drive; Type: Resistor; ComponentLink1Description: Chip&Dip; ComponentLink1URL: https://www.chipdip.ru/product0/9000079676
R33#2 = Res 39k (0603): 0.1W 0603 39k, 1%; Part Number: RC0603FR-0739KL; Manufacturer: Taiwan; Type: Resistor; ComponentLink1Description: Chip&Dip; ComponentLink1URL: https://www.chipdip.ru/product0/9000079750
R34#2 = Res 120k (0603): 0.1W 0603 120k, 1%; Part Number: RC0603FR-07120KL; Manufacturer: Taiwan; Type: Resistor; ComponentLink1Description: Chip&Dip; ComponentLink1URL: https://www.chipdip.ru/product0/9000079762
U7#2 = LDO 3.3V [L78]: The L78L series of three-terminal positive regulators employ internal current limiting and thermal shutdown, making them essentially indestructible; Manufacturer: STMicroelectronics; ComponentLink1Description: DataSheet; ComponentLink1URL: https://static.chipdip.ru/lib/837/DOC011837500.pdf; ComponentLink2Description: Chip&Dip; ComponentLink2URL: https://www.chipdip.ru/product/l78l33acd; Type: IC
U8#2 = DC/DC Controller [TPS5450DDAR]: The TPS5450 is  a  high-output-current PWM converter that integrates a low-resistance, high-side N-channel MOSFET; Manufacturer: Texas Instruments; ComponentLink1Description: Chip&Dip; ComponentLink1URL: https://www.chipdip.ru/product/tps5450ddar-2; ComponentLink2Description: DataSheet; ComponentLink2URL: https://static.chipdip.ru/lib/787/DOC004787015.pdf; Type: IC

## Nets that join several sheets
+3.3V: BLDC_Drive (32 pins), Half-Bridge Phase1 (C33#2.1 R28#2.2 U6#2.5), Half-Bridge Phase2 (C34#1.1 R39#2.2 U7#1.5), Half-Bridge Phase3 (C35#1.1 R50.2 U8#1.5), Power (C44.2 C45.2 U7#2.1)
+20V: BLDC_Drive (D1.1 D2.1 D4.1 U2.1), Power (9 pins)
GND: BLDC_Drive (59 pins), Half-Bridge Phase1 (7 pins), Half-Bridge Phase2 (7 pins), Half-Bridge Phase3 (7 pins), Power (24 pins)
VBUS: BLDC_Drive (10 pins), Half-Bridge Phase1 (Q3#2.2), Half-Bridge Phase2 (Q5.2), Half-Bridge Phase3 (Q7.2), Power (FU1.1)
CurrentSens1: BLDC_Drive (U3.8), Half-Bridge Phase1 (D12.2 R34#1.2 U6#2.4)
CurrentSens2: BLDC_Drive (U3.9), Half-Bridge Phase2 (D15#1.2 R45.2 U7#1.4)
CurrentSens3: BLDC_Drive (U3.10), Half-Bridge Phase3 (D18.2 R56.2 U8#1.4)
HO1: BLDC_Drive (U2.27), Half-Bridge Phase1 (D10.2 R25#2.1)
HO2: BLDC_Drive (U2.23), Half-Bridge Phase2 (D13#1.2 R36#2.1)
HO3: BLDC_Drive (U2.19), Half-Bridge Phase3 (D16.2 R47.1)
LO1: BLDC_Drive (U2.16), Half-Bridge Phase1 (D11.2 R27#2.1)
LO2: BLDC_Drive (U2.15), Half-Bridge Phase2 (D14#1.2 R38#2.1)
LO3: BLDC_Drive (U2.14), Half-Bridge Phase3 (D17.2 R49.1)
VS1: BLDC_Drive (C9.1 J9.1 U2.26), Half-Bridge Phase1 (Q3#2.3 Q4#2.2)
VS2: BLDC_Drive (C10.1 J10.1 U2.22), Half-Bridge Phase2 (Q5.3 Q6.2)
VS3: BLDC_Drive (C12.1 J11.1 U2.18), Half-Bridge Phase3 (Q7.3 Q8.2)